# Altium schematic sheet Nestling_2.1_EXB_IO.SchDoc
size A4
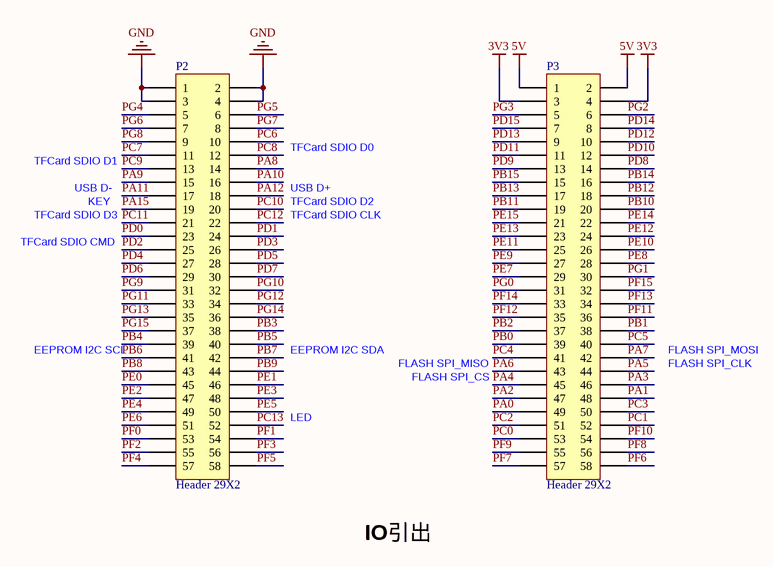
[diagram p0: Nestling_2.1_EXB_IO.SchDoc]

## Parts
P2  Header 29X2  [HDR2X29]
P3  Header 29X2  [HDR2X29]

## Nets
3V3: P3.3 P3.4
5V: P3.1 P3.2
GND: P2.1 P2.2 P2.3 P2.4
PA0: P3.49
PA1: P3.48
PA2: P3.47
PA3: P3.46
PA4: P3.45
PA5: P3.44
PA6: P3.43
PA7: P3.42
PA8: P2.14
PA9: P2.15
PA10: P2.16
PA11: P2.17
PA12: P2.18
PA15: P2.19
PB0: P3.39
PB1: P3.38
PB2: P3.37
PB3: P2.38
PB4: P2.39
PB5: P2.40
PB6: P2.41
PB7: P2.42
PB8: P2.43
PB9: P2.44
PB10: P3.20
PB11: P3.19
PB12: P3.18
PB13: P3.17
PB14: P3.16
PB15: P3.15
PC0: P3.53
PC1: P3.52
PC2: P3.51
PC3: P3.50
PC4: P3.41
PC5: P3.40
PC6: P2.10
PC7: P2.11
PC8: P2.12
PC9: P2.13
PC10: P2.20
PC11: P2.21
PC12: P2.22
PC13: P2.52
PD0: P2.23
PD1: P2.24
PD2: P2.25
PD3: P2.26
PD4: P2.27
PD5: P2.28
PD6: P2.29
PD7: P2.30
PD8: P3.14
PD9: P3.13
PD10: P3.12
PD11: P3.11
PD12: P3.10
PD13: P3.9
PD14: P3.8
PD15: P3.7
PE0: P2.45
PE1: P2.46
PE2: P2.47
PE3: P2.48
PE4: P2.49
PE5: P2.50
PE6: P2.51
PE7: P3.29
PE8: P3.28
PE9: P3.27
PE10: P3.26
PE11: P3.25
PE12: P3.24
PE13: P3.23
PE14: P3.22
PE15: P3.21
PF0: P2.53
PF1: P2.54
PF2: P2.55
PF3: P2.56
PF4: P2.57
PF5: P2.58
PF6: P3.58
PF7: P3.57
PF8: P3.56
PF9: P3.55
PF10: P3.54
PF11: P3.36
PF12: P3.35
PF13: P3.34
PF14: P3.33
PF15: P3.32
PG0: P3.31
PG1: P3.30
PG2: P3.6
PG3: P3.5
PG4: P2.5
PG5: P2.6
PG6: P2.7
PG7: P2.8
PG8: P2.9
PG9: P2.31
PG10: P2.32
PG11: P2.33
PG12: P2.34
PG13: P2.35
PG14: P2.36
PG15: P2.37

## Notes on the sheet
- TFCard SDIO D0
- TFCard SDIO D1
- TFCard SDIO D3
- USB D-
- KEY
- USB D+
- TFCard SDIO D2
- TFCard SDIO CLK
- TFCard SDIO CMD
- EEPROM I2C SCL
- EEPROM I2C SDA
- FLASH SPI_MOSI
- LED
- FLASH SPI_MISO
- FLASH SPI_CS
- FLASH SPI_CLK
- IO引出